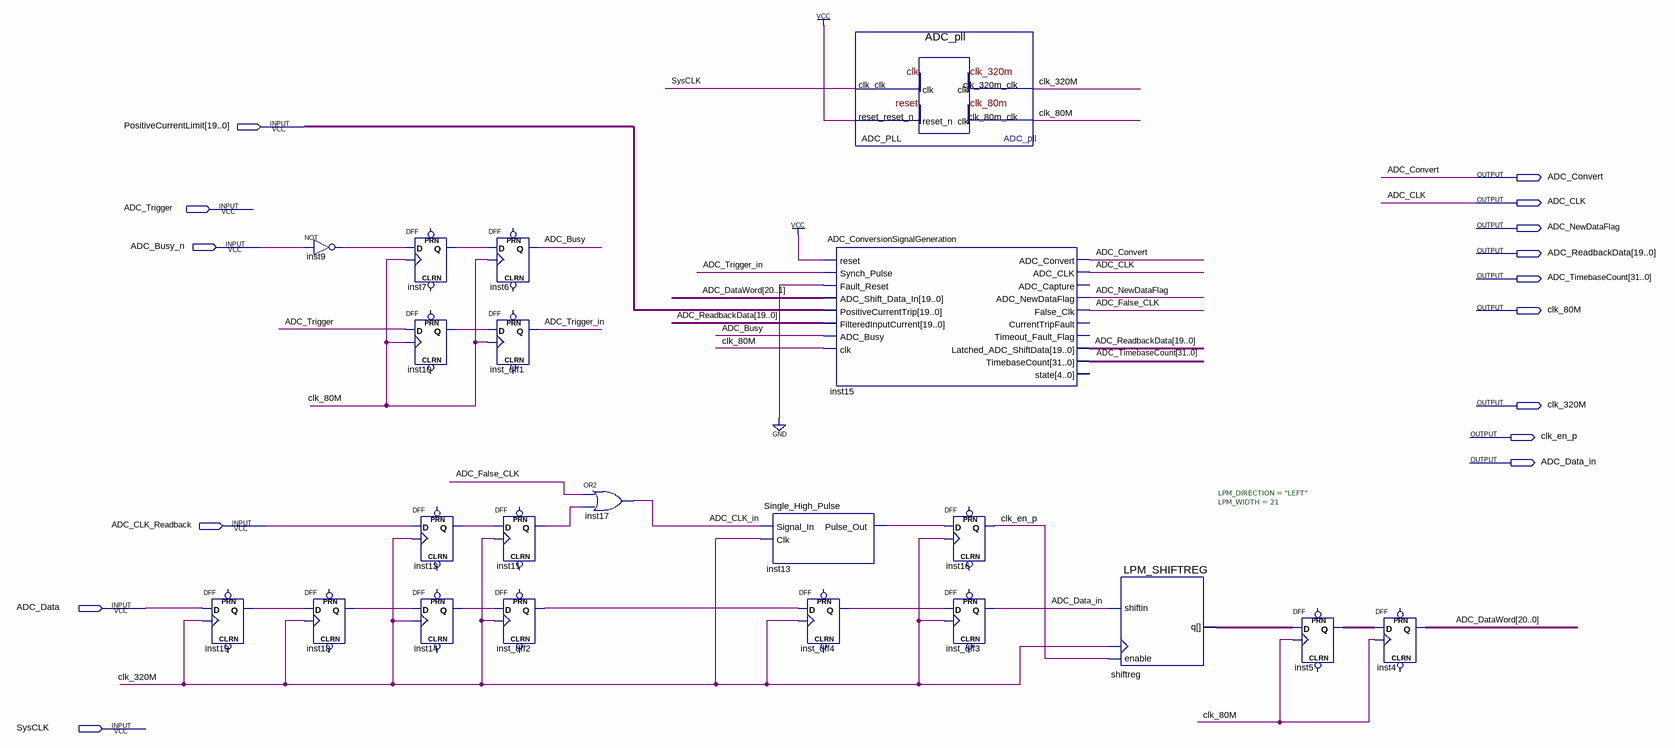
[diagram p0: schematic sheet]
// Quartus schematic ADCReadbackTopLevel.bdf as structural Verilog: 21 symbols, 15 pins
module ADCReadbackTopLevel (
  input  [19:0] PositiveCurrentLimit,
  input  ADC_Trigger,
  input  ADC_Busy_n,
  input  ADC_CLK_Readback,
  input  ADC_Data,
  input  SysCLK,
  output ADC_Convert,
  output ADC_CLK,
  output ADC_NewDataFlag,
  output [19:0] ADC_ReadbackData,
  output [31:0] ADC_TimebaseCount,
  output clk_80M,
  output clk_320M,
  output clk_en_p,
  output ADC_Data_in
);

  wire ADC_Busy, ADC_CLK_in, ADC_False_CLK, ADC_Trigger_in, inst7_q, inst9_out, inst10_q, inst11_q, inst12_q,
       inst13_pulse_out, inst14_q, inst18_q, inst19_q, inst_dff2_q, inst_dff4_q;
  wire [20:0] ADC_DataWord, inst5_q, shiftreg_q;

  DFF inst19 (.CLK(clk_320M), .D(ADC_Data), .Q(inst19_q));  // open: CLRN, PRN
  not inst9 (inst9_out, ADC_Busy_n);
  DFF inst18 (.CLK(clk_320M), .D(inst19_q), .Q(inst18_q));  // open: CLRN, PRN
  DFF inst7 (.CLK(clk_80M), .D(inst9_out), .Q(inst7_q));  // open: CLRN, PRN
  DFF inst10 (.CLK(clk_80M), .D(ADC_Trigger), .Q(inst10_q));  // open: CLRN, PRN
  DFF inst12 (.CLK(clk_320M), .D(ADC_CLK_Readback), .Q(inst12_q));  // open: CLRN, PRN
  DFF inst14 (.CLK(clk_320M), .D(inst18_q), .Q(inst14_q));  // open: CLRN, PRN
  DFF inst6 (.CLK(clk_80M), .D(inst7_q), .Q(ADC_Busy));  // open: CLRN, PRN
  DFF inst_dff1 (.CLK(clk_80M), .D(inst10_q), .Q(ADC_Trigger_in));  // open: CLRN, PRN
  DFF inst11 (.CLK(clk_320M), .D(inst12_q), .Q(inst11_q));  // open: CLRN, PRN
  DFF inst_dff2 (.CLK(clk_320M), .D(inst14_q), .Q(inst_dff2_q));  // open: CLRN, PRN
  or inst17 (ADC_CLK_in, ADC_False_CLK, inst11_q);
  Single_High_Pulse inst13 (.Signal_In(ADC_CLK_in), .Clk(clk_320M), .Pulse_Out(inst13_pulse_out));
  ADC_ConversionSignalGeneration inst15 (
    .reset(1'b1), .Synch_Pulse(ADC_Trigger_in), .Fault_Reset(1'b0), .ADC_Shift_Data_In(ADC_DataWord[20:1]),
    .PositiveCurrentTrip(PositiveCurrentLimit), .FilteredInputCurrent(ADC_ReadbackData), .ADC_Busy(ADC_Busy),
    .clk(clk_80M), .ADC_Convert(ADC_Convert), .ADC_CLK(ADC_CLK), .ADC_NewDataFlag(ADC_NewDataFlag),
    .False_Clk(ADC_False_CLK), .Latched_ADC_ShiftData(ADC_ReadbackData), .TimebaseCount(ADC_TimebaseCount));  // open: ADC_Capture, CurrentTripFault, Timeout_Fault_Flag, state
  DFF inst_dff4 (.CLK(clk_320M), .D(inst_dff2_q), .Q(inst_dff4_q));  // open: CLRN, PRN
  ADC_pll ADC_PLL (.clk_clk(SysCLK), .reset_reset_n(1'b1), .clk_320m_clk(clk_320M), .clk_80m_clk(clk_80M));
  DFF inst16 (.CLK(clk_320M), .D(inst13_pulse_out), .Q(clk_en_p));  // open: CLRN, PRN
  DFF inst_dff3 (.CLK(clk_320M), .D(inst_dff4_q), .Q(ADC_Data_in));  // open: CLRN, PRN
  LPM_SHIFTREG #(.LPM_DIRECTION("LEFT"), .LPM_WIDTH(21)) shiftreg (
    .clock(clk_320M), .enable(clk_en_p), .shiftin(ADC_Data_in), .q(shiftreg_q));
  DFF inst5[20:0] (.CLK(clk_80M), .D(shiftreg_q), .Q(inst5_q));  // open: CLRN, PRN
  DFF inst4[20:0] (.CLK(clk_80M), .D(inst5_q), .Q(ADC_DataWord));  // open: CLRN, PRN
endmodule
